# Altium project Merge2.PrjPcb
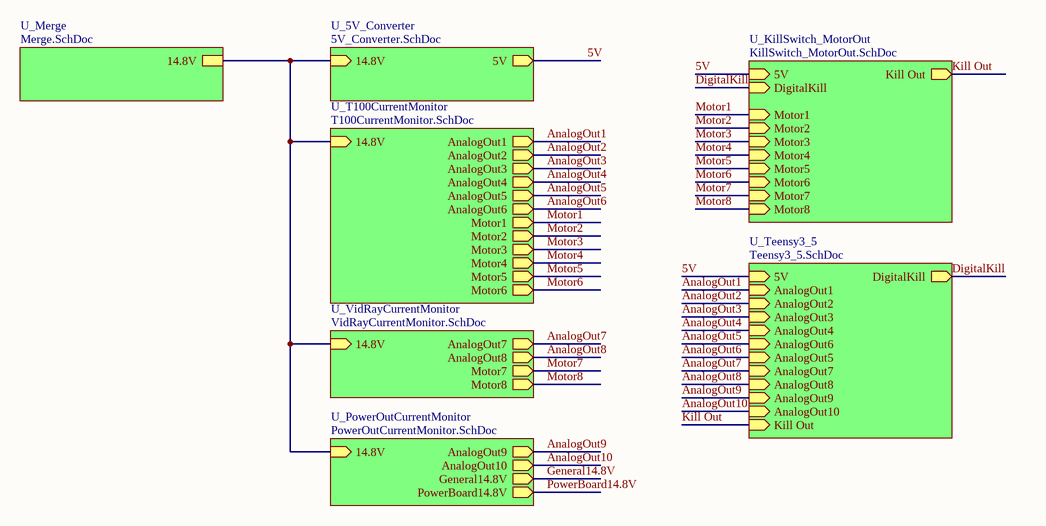
[diagram p0: MergeBoard.SchDoc]
5 sheets, 31 parts. Net scope: hierarchical (ports join the sheet entries above them; power ports are global).
Board files: Merge.PcbDoc, MergeBoard.PcbDoc
Sheets:
  MergeBoard.SchDoc
    U_5V_Converter = 5V_Converter.SchDoc
    U_PowerOutCurrentMonitor = PowerOutCurrentMonitor.SchDoc
    U_Teensy3_5 = Teensy3_5.SchDoc
    U_KillSwitch_MotorOut = KillSwitch_MotorOut.SchDoc

## Sheet MergeBoard.SchDoc
size A

### Sub-sheets
U_5V_Converter = 5V_Converter.SchDoc: 14.8V (in), 5V (out)
U_KillSwitch_MotorOut = KillSwitch_MotorOut.SchDoc: Motor8 (in), Motor7 (in), DigitalKill (in), Kill Out (out), Motor1 (in), Motor2 (in), Motor3 (in), Motor4 (in), Motor5 (in), Motor6 (in), 5V (in)
U_Merge = Merge.SchDoc (file not in this document): 14.8V
U_PowerOutCurrentMonitor = PowerOutCurrentMonitor.SchDoc: General14.8V (out), PowerBoard14.8V (out), 14.8V (in), AnalogOut9 (out), AnalogOut10 (out)
U_T100CurrentMonitor = T100CurrentMonitor.SchDoc (file not in this document): AnalogOut1 (out), AnalogOut2 (out), AnalogOut3 (out), AnalogOut4 (out), AnalogOut5 (out), AnalogOut6 (out), Motor1 (out), Motor2 (out), Motor3 (out), Motor4 (out), Motor5 (out), Motor6 (out), 14.8V (in)
U_Teensy3_5 = Teensy3_5.SchDoc: 5V (in), DigitalKill (out), AnalogOut1 (in), AnalogOut2 (in), AnalogOut3 (in), AnalogOut4 (in), AnalogOut6 (in), AnalogOut5 (in), AnalogOut7 (in), AnalogOut8 (in), Kill Out (in), AnalogOut9 (in), AnalogOut10 (in)
U_VidRayCurrentMonitor = VidRayCurrentMonitor.SchDoc (file not in this document): AnalogOut7 (out), AnalogOut8 (out), Motor7 (out), Motor8 (out), 14.8V (in)

### Nets
5V: sheet U_5V_Converter/5V, sheet U_Teensy3_5/5V, sheet U_KillSwitch_MotorOut/5V
AnalogOut1: sheet U_T100CurrentMonitor/AnalogOut1, sheet U_Teensy3_5/AnalogOut1
AnalogOut2: sheet U_T100CurrentMonitor/AnalogOut2, sheet U_Teensy3_5/AnalogOut2
AnalogOut3: sheet U_T100CurrentMonitor/AnalogOut3, sheet U_Teensy3_5/AnalogOut3
AnalogOut4: sheet U_T100CurrentMonitor/AnalogOut4, sheet U_Teensy3_5/AnalogOut4
AnalogOut5: sheet U_T100CurrentMonitor/AnalogOut5, sheet U_Teensy3_5/AnalogOut6
AnalogOut6: sheet U_T100CurrentMonitor/AnalogOut6, sheet U_Teensy3_5/AnalogOut5
AnalogOut7: sheet U_VidRayCurrentMonitor/AnalogOut7, sheet U_Teensy3_5/AnalogOut7
AnalogOut8: sheet U_VidRayCurrentMonitor/AnalogOut8, sheet U_Teensy3_5/AnalogOut8
AnalogOut9: sheet U_PowerOutCurrentMonitor/AnalogOut9, sheet U_Teensy3_5/AnalogOut9
AnalogOut10: sheet U_PowerOutCurrentMonitor/AnalogOut10, sheet U_Teensy3_5/AnalogOut10
DigitalKill: sheet U_Teensy3_5/DigitalKill, sheet U_KillSwitch_MotorOut/DigitalKill
Kill Out: sheet U_Teensy3_5/Kill Out, sheet U_KillSwitch_MotorOut/Kill Out
Motor1: sheet U_T100CurrentMonitor/Motor1, sheet U_KillSwitch_MotorOut/Motor1
Motor2: sheet U_T100CurrentMonitor/Motor2, sheet U_KillSwitch_MotorOut/Motor2
Motor3: sheet U_T100CurrentMonitor/Motor3, sheet U_KillSwitch_MotorOut/Motor3
Motor4: sheet U_T100CurrentMonitor/Motor4, sheet U_KillSwitch_MotorOut/Motor4
Motor5: sheet U_T100CurrentMonitor/Motor5, sheet U_KillSwitch_MotorOut/Motor5
Motor6: sheet U_T100CurrentMonitor/Motor6, sheet U_KillSwitch_MotorOut/Motor6
Motor7: sheet U_VidRayCurrentMonitor/Motor7, sheet U_KillSwitch_MotorOut/Motor7
Motor8: sheet U_VidRayCurrentMonitor/Motor8, sheet U_KillSwitch_MotorOut/Motor8
NetC1_2: sheet U_5V_Converter/14.8V, sheet U_T100CurrentMonitor/14.8V, sheet U_VidRayCurrentMonitor/14.8V, sheet U_PowerOutCurrentMonitor/14.8V, sheet U_Merge/14.8V

## Sheet 5V_Converter.SchDoc
size A
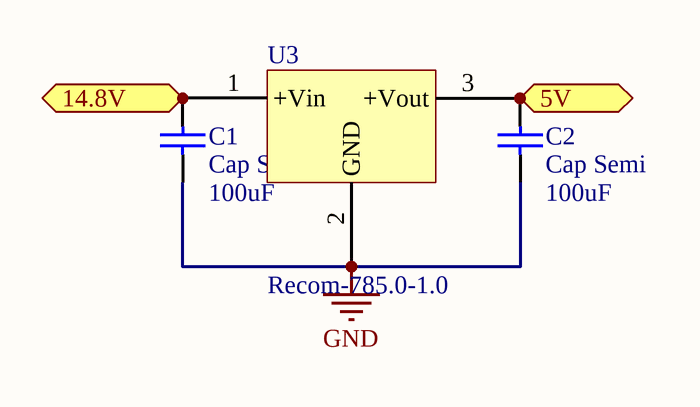
[diagram p1: 5V_Converter.SchDoc]

### Parts
C1  Cap Semi  value 100uF  [C1206]
C2  Cap Semi  value 100uF  [C1206]
U3  Recom-785.0-1.0  [Recom-78E5.0-1.0]

### Ports
5V (out), 14.8V (in)

### Nets
GND: C1.1 C2.1 U3.2(GND)
5V: C2.2 U3.3(+Vout) ; port 5V
NetC1_2: C1.2 U3.1(+Vin) ; port 14.8V

### Library data of the parts
C1 C2 = Cap Semi: Capacitor (Semiconductor SIM Model); Published: 8-Jun-2000; LatestRevisionDate: 29-May-2009; LatestRevisionNote: IPC-7351 Footprint Added.; PackageReference: C1206; Publisher: Altium Limited; PackageDescription: Chip Capacitor

## Sheet PowerOutCurrentMonitor.SchDoc
size A
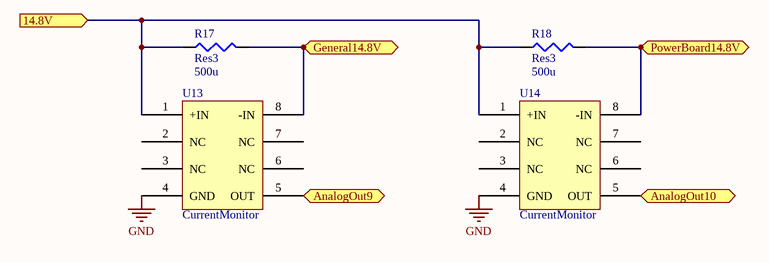
[diagram p2: PowerOutCurrentMonitor.SchDoc]

### Parts
R17  Res3  value 500u  [Resistor05MOHM]
R18  Res3  value 500u  [Resistor05MOHM]
U13  CurrentMonitor  [AD8217]
U14  CurrentMonitor  [AD8217]

### Ports
14.8V (in), AnalogOut9 (out), AnalogOut10 (out), General14.8V (out), PowerBoard14.8V (out)

### Nets
GND: U13.4(GND) U14.4(GND)
AnalogOut9: U13.5(OUT) ; port AnalogOut9
AnalogOut10: U14.5(OUT) ; port AnalogOut10
General14.8V: R17.2 U13.8(-IN) ; port General14.8V
PowerBoard14.8V: R18.2 U14.8(-IN) ; port PowerBoard14.8V
NetC1_2: R17.1 R18.1 U13.1(+IN) U14.1(+IN) ; port 14.8V

Not connected (* = marked no-connect by the designer): U13 2(NC) 3(NC) 6(NC) 7(NC); U14 2(NC) 3(NC) 6(NC) 7(NC)

### Library data of the parts
R17 R18 = Res3: Resistor; Published: 8-Jun-2000; LatestRevisionDate: 29-May-2009; LatestRevisionNote: IPC-7351 Footprint Added.; PackageReference: J1-0603; Publisher: Altium Limited; PackageDescription: Chip Resistor
U13 U14 = AD8217

## Sheet Teensy3_5.SchDoc
size A
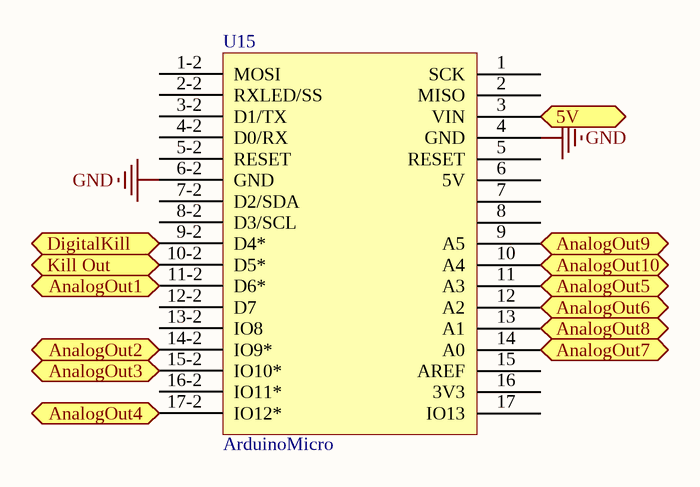
[diagram p3: Teensy3_5.SchDoc]

### Parts
U15  ArduinoMicro  [ArduinoMicro]

### Ports
5V (in), AnalogOut1 (in), AnalogOut2 (in), AnalogOut3 (in), AnalogOut4 (in), AnalogOut5 (in), AnalogOut6 (in), AnalogOut7 (in), AnalogOut8 (in), AnalogOut9 (in), AnalogOut10 (in), DigitalKill (out), Kill Out (in)

### Nets
GND: U15.4(GND) U15.6-2(GND)
5V: U15.3(VIN) ; port 5V
AnalogOut1: U15.11-2(D6*) ; port AnalogOut1
AnalogOut2: U15.14-2(IO9*) ; port AnalogOut2
AnalogOut3: U15.15-2(IO10*) ; port AnalogOut3
AnalogOut4: U15.17-2(IO12*) ; port AnalogOut4
AnalogOut5: U15.12(A2) ; port AnalogOut6
AnalogOut6: U15.11(A3) ; port AnalogOut5
AnalogOut7: U15.14(A0) ; port AnalogOut7
AnalogOut8: U15.13(A1) ; port AnalogOut8
AnalogOut9: U15.9(A5) ; port AnalogOut9
AnalogOut10: U15.10(A4) ; port AnalogOut10
DigitalKill: U15.9-2(D4*) ; port DigitalKill
Kill Out: U15.10-2(D5*) ; port Kill Out

Not connected (* = marked no-connect by the designer): U15 1(SCK) 1-2(MOSI) 2(MISO) 2-2(RXLED/SS) 3-2(D1/TX) 4-2(D0/RX) 5(RESET) 5-2(RESET) 6(5V) 7 7-2(D2/SDA) 8 8-2(D3/SCL) 12-2(D7) 13-2(IO8) 15(AREF) 16(3V3) 16-2(IO11*) 17(IO13)

## Sheet KillSwitch_MotorOut.SchDoc
size A
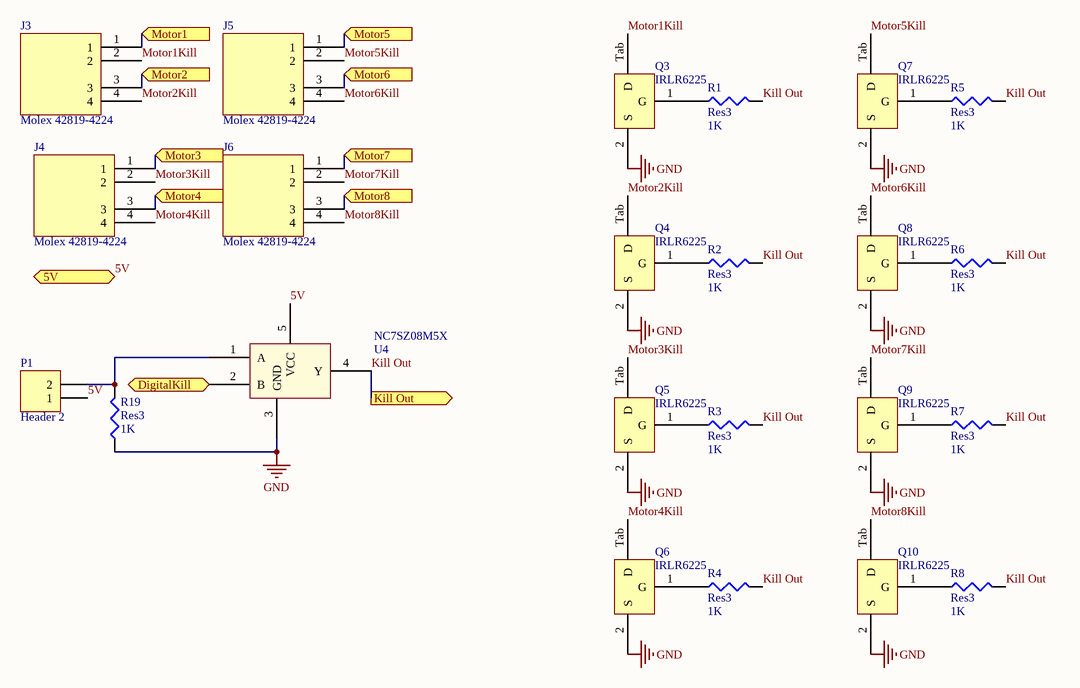
[diagram p4: KillSwitch_MotorOut.SchDoc]

### Parts
J3  Molex 42819-4224  [MOLEX_42819-4224]
J4  Molex 42819-4224  [MOLEX_42819-4224]
J5  Molex 42819-4224  [MOLEX_42819-4224]
J6  Molex 42819-4224  [MOLEX_42819-4224]
NC7SZ08M5X  U4  [NC7SZ08M5X]
P1  Header 2  [HDR1X2]
Q3  IRLR6225  [IRLR6225]
Q4  IRLR6225  [IRLR6225]
Q5  IRLR6225  [IRLR6225]
Q6  IRLR6225  [IRLR6225]
Q7  IRLR6225  [IRLR6225]
Q8  IRLR6225  [IRLR6225]
Q9  IRLR6225  [IRLR6225]
Q10  IRLR6225  [IRLR6225]
R1  Res3  value 1K  [J1-0603]
R2  Res3  value 1K  [J1-0603]
R3  Res3  value 1K  [J1-0603]
R4  Res3  value 1K  [J1-0603]
R5  Res3  value 1K  [J1-0603]
R6  Res3  value 1K  [J1-0603]
R7  Res3  value 1K  [J1-0603]
R8  Res3  value 1K  [J1-0603]
R19  Res3  value 1K  [J1-0603]

### Ports
5V (in), DigitalKill (in), Kill Out (out), Motor1 (in), Motor2 (in), Motor3 (in), Motor4 (in), Motor5 (in), Motor6 (in), Motor7 (in), Motor8 (in)

### Nets
GND: NC7SZ08M5X.3(GND) Q3.2(S) Q4.2(S) Q5.2(S) Q6.2(S) Q7.2(S) Q8.2(S) Q9.2(S) Q10.2(S) R19.1
5V: NC7SZ08M5X.5(VCC) P1.1 ; port 5V
DigitalKill: NC7SZ08M5X.2(B) ; port DigitalKill
Kill Out: NC7SZ08M5X.4(Y) R1.2 R2.2 R3.2 R4.2 R5.2 R6.2 R7.2 R8.2 ; port Kill Out
Motor1: J3.1 ; port Motor1
Motor1Kill: J3.2 Q3.Tab(D)
Motor2: J3.3 ; port Motor2
Motor2Kill: J3.4 Q4.Tab(D)
Motor3: J4.1 ; port Motor3
Motor3Kill: J4.2 Q5.Tab(D)
Motor4: J4.3 ; port Motor4
Motor4Kill: J4.4 Q6.Tab(D)
Motor5: J5.1 ; port Motor5
Motor5Kill: J5.2 Q7.Tab(D)
Motor6: J5.3 ; port Motor6
Motor6Kill: J5.4 Q8.Tab(D)
Motor7: J6.1 ; port Motor7
Motor7Kill: J6.2 Q9.Tab(D)
Motor8: J6.3 ; port Motor8
Motor8Kill: J6.4 Q10.Tab(D)
NetNC7SZ08M5X_1: NC7SZ08M5X.1(A) P1.2 R19.2
NetQ3_1: Q3.1(G) R1.1
NetQ4_1: Q4.1(G) R2.1
NetQ5_1: Q5.1(G) R3.1
NetQ6_1: Q6.1(G) R4.1
NetQ7_1: Q7.1(G) R5.1
NetQ8_1: Q8.1(G) R6.1
NetQ9_1: Q9.1(G) R7.1
NetQ10_1: Q10.1(G) R8.1

### Library data of the parts
J3-J6 = Molex_42819-4224
NC7SZ08M5X = NC7SZ08M5X
P1 = Header 2: Header, 2-Pin; LatestRevisionDate: 17-Jul-2002; LatestRevisionNote: Re-released for DXP Platform.; Publisher: Altium Limited
R1-R8 R19 = Res3: Resistor; Published: 8-Jun-2000; LatestRevisionDate: 29-May-2009; LatestRevisionNote: IPC-7351 Footprint Added.; PackageReference: J1-0603; Publisher: Altium Limited; PackageDescription: Chip Resistor

## Nets that join several sheets
GND: 5V_Converter (C1.1 C2.1 U3.2), PowerOutCurrentMonitor (U13.4 U14.4), Teensy3_5 (U15.4 U15.6-2), KillSwitch_MotorOut (10 pins)
5V: 5V_Converter (C2.2 U3.3), Teensy3_5 (U15.3), KillSwitch_MotorOut (NC7SZ08M5X.5 P1.1)
AnalogOut9: PowerOutCurrentMonitor (U13.5), Teensy3_5 (U15.9)
AnalogOut10: PowerOutCurrentMonitor (U14.5), Teensy3_5 (U15.10)
DigitalKill: Teensy3_5 (U15.9-2), KillSwitch_MotorOut (NC7SZ08M5X.2)
Kill Out: Teensy3_5 (U15.10-2), KillSwitch_MotorOut (9 pins)
NetC1_2: 5V_Converter (C1.2 U3.1), PowerOutCurrentMonitor (R17.1 R18.1 U13.1 U14.1)